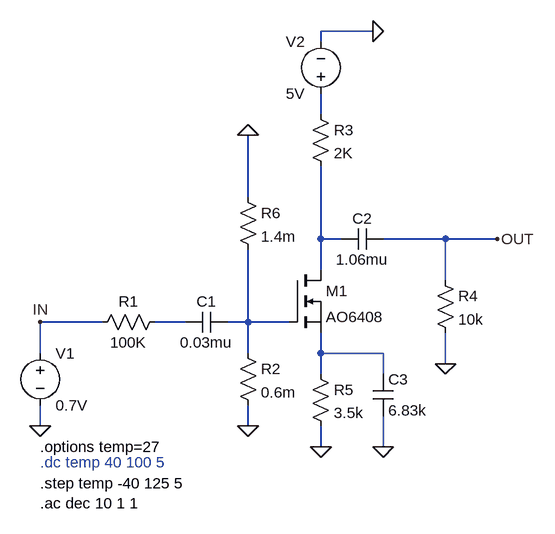
[diagram p0: schematic simulation.asc]
simulation.asc, the LTspice schematic file:
Version 4.1
SHEET 1 880 680
WIRE 464 -352 384 -352
WIRE 384 -336 384 -352
WIRE 384 -224 384 -256
WIRE 272 -96 272 -192
WIRE 384 -32 384 -144
WIRE 416 -32 384 -32
WIRE 576 -32 480 -32
WIRE 656 -32 576 -32
WIRE 384 16 384 -32
WIRE 576 32 576 -32
WIRE 48 96 -48 96
WIRE 176 96 128 96
WIRE 272 96 272 -16
WIRE 272 96 240 96
WIRE 336 96 272 96
WIRE -48 144 -48 96
WIRE 272 144 272 96
WIRE 384 144 384 112
WIRE 480 144 384 144
WIRE 576 160 576 112
WIRE 384 176 384 144
WIRE 480 176 480 144
WIRE -48 256 -48 224
WIRE 272 256 272 224
WIRE 384 288 384 256
WIRE 480 288 480 240
FLAG -48 256 0
FLAG 272 256 0
FLAG 576 160 0
FLAG 480 288 0
FLAG 384 288 0
FLAG 464 -352 0
FLAG 656 -32 OUT
FLAG 272 -192 0
FLAG -48 96 IN
SYMBOL voltage -48 128 R0
SYMATTR InstName V1
SYMATTR Value 0.7V
SYMBOL res 144 80 R90
WINDOW 0 0 56 VBottom 2
WINDOW 3 32 56 VTop 2
SYMATTR InstName R1
SYMATTR Value 100K
SYMBOL cap 240 80 R90
WINDOW 0 0 32 VBottom 2
WINDOW 3 32 32 VTop 2
SYMATTR InstName C1
SYMATTR Value 0.03mu
SYMBOL res 256 128 R0
SYMATTR InstName R2
SYMATTR Value 0.6m
SYMBOL nmos 336 16 R0
SYMATTR InstName M1
SYMATTR Value AO6408
SYMBOL cap 480 -48 R90
WINDOW 0 0 32 VBottom 2
WINDOW 3 32 32 VTop 2
SYMATTR InstName C2
SYMATTR Value 1.06mu
SYMBOL res 368 -240 R0
SYMATTR InstName R3
SYMATTR Value 2K
SYMBOL res 560 16 R0
SYMATTR InstName R4
SYMATTR Value 10k
SYMBOL cap 464 176 R0
SYMATTR InstName C3
SYMATTR Value 6.83k
SYMBOL voltage 384 -240 R180
WINDOW 0 24 96 Left 2
WINDOW 3 24 16 Left 2
WINDOW 123 0 0 Left 0
WINDOW 39 0 0 Left 0
SYMATTR InstName V2
SYMATTR Value 5V
SYMBOL res 368 160 R0
SYMATTR InstName R5
SYMATTR Value 3.5k
SYMBOL res 256 -112 R0
SYMATTR InstName R6
SYMATTR Value 1.4m
TEXT -48 288 Left 2 !.options temp=27
TEXT -48 312 Left 2 ;.dc temp 40 100 5
TEXT -48 344 Left 2 !.step temp -40 125 5\n.ac dec 10 1 1

The netlist it stands for:
* simulation.asc
V1 IN 0 0.7V
R1 N003 IN 100K
C1 N004 N003 0.03mu
R2 N004 0 0.6m
M1 N002 N004 N005 N005 AO6408
C2 OUT N002 1.06mu
R3 N001 N002 2K
R4 OUT 0 10k
C3 N005 0 6.83k
V2 N001 0 5V
R5 N005 0 3.5k
R6 0 N004 1.4m
.model NMOS NMOS
.model PMOS PMOS
.lib standard.mos
.options temp=27
* .dc temp 40 100 5
.step temp -40 125 5
.ac dec 10 1 1
.backanno
.end